# Altium schematic sheet Power.SchDoc
size A4; SheetNumber: 2; SheetTotal: 3
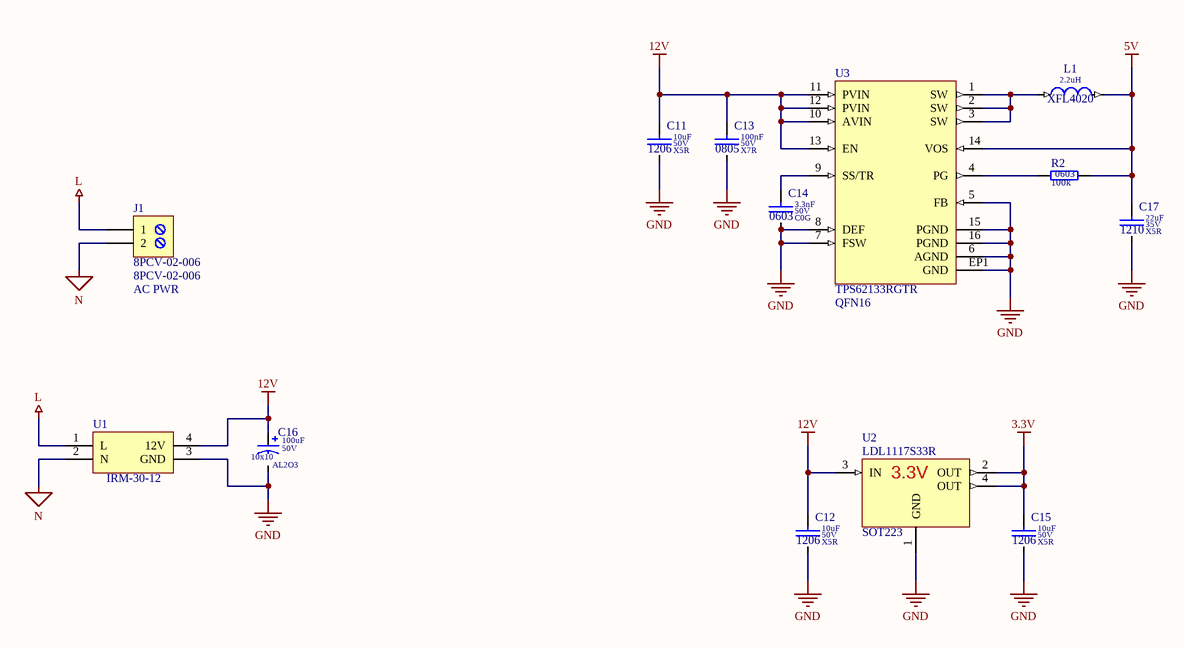
[diagram p0: Power.SchDoc]

## Parts
C11  value 10uF  Dielectric: X5R  Voltage: 50V  SCH_Footprint: 1206  [C_1206_3216]  (hidden comment: Ceramic X5R)
C12  value 10uF  Dielectric: X5R  Voltage: 50V  SCH_Footprint: 1206  [C_1206_3216]  (hidden comment: Ceramic X5R)
C13  value 100nF  Dielectric: X7R  Voltage: 50V  SCH_Footprint: 0805  [C_0805_2012]  (hidden comment: Ceramic X7R)
C14  value 3.3nF  Dielectric: C0G  Voltage: 50V  SCH_Footprint: 0603  [C_0603_1608]  (hidden comment: Ceramic C0G)
C15  value 10uF  Dielectric: X5R  Voltage: 50V  SCH_Footprint: 1206  [C_1206_3216]  (hidden comment: Ceramic X5R)
C16  value 100uF  Dielectric: AL2O3  SCH_Footprint: 10x10  Voltage: 50V  [CE_D_10x10_SMD]  (hidden comment: Electrolytic Capacitor)
C17  value 22uF  Dielectric: X5R  Voltage: 35V  SCH_Footprint: 1210  [C_1210_3225]  (hidden comment: Ceramic X5R)
J1  value 8PCV-02-006  [J_8PCV-02-006]  (hidden comment: 600V 30A connector)
L1  value 2.2uH  [XFL4020]  (hidden comment: Inductor)
R2  value 100k  SCH_Footprint: 0603  [R_0603_1608]  (hidden comment: Resistor)
U1  IRM-30-12  [IRM-30-12]
U2  SCH_Footprint: SOT223  [SOT223_SC73]  (hidden comment: LDL1117S33R)
U3  SCH_Footprint: QFN16  [QFN16_3x3]  (hidden comment: TPS62133RGTR)

## Nets
3.3V: C15.1 U2.2(OUT) U2.4(OUT)
5V: C17.1 L1.2 R2.2 U3.14(VOS)
12V: C11.1 C12.1 C13.1 C16.1 U1.4(12V) U2.3(IN) U3.10(AVIN) U3.11(PVIN) U3.12(PVIN) U3.13(EN)
GND: C11.2 C12.2 C13.2 C14.2 C15.2 C16.2 C17.2 U1.3(GND) U2.1(GND) U3.5(FB) U3.6(AGND) U3.7(FSW) U3.8(DEF) U3.15(PGND) U3.16(PGND) U3.EP1(GND)
L: J1.1 U1.1(L)
N: J1.2 U1.2(N)
NetC14_1: C14.1 U3.9(SS/TR)
NetL1_1: L1.1 U3.1(SW) U3.2(SW) U3.3(SW)
NetR2_1: R2.1 U3.4(PG)

## Notes on the sheet
- (near J1) AC PWR

## Library data of the parts
C11 C12 C15 = C_10uF_50V_X5R_1206_10: Capacitor; Manufacturer: Murata; Manufacturer Part Number: GRM31CR61H106KA12L; Tolerance (%): 10; Part Number: C_10uF_50V_X5R_1206_10; HelpURL: https://datasheet.octopart.com/GRM31CR61H106KA12L-Murata-datasheet-138746367.pdf; Supplier 1: TME; Supplier Part Number 1: GRM31CR61H106KA12L; Supplier 2: RS Components; Supplier 3: Farnell; Supplier Part Number 3: 1845762; Supplier 4: Mouser; Supplier 5: Digi-Key; Supplier 6: LCSC
C13 = C_100nF_50V_X7R_0805_10: Capacitor; Manufacturer: AVX; Manufacturer Part Number: 08055C104K4T2A; Tolerance (%): 10; Part Number: C_100nF_50V_X7R_0805_10; HelpURL: http://www.tme.eu/pl/Document/943bdb20b23b898c4d4b2ec4eca4f2b6/cauto.pdf; Supplier 1: TME; Supplier Part Number 1: 08055C104K4T2A; Supplier 2: RS Components; Supplier 3: Farnell; Supplier 4: Mouser; Supplier 5: Digi-Key; Supplier 6: LCSC
C14 = C_3.3nF_50V_C0G_0603_5: Capacitor; Manufacturer: Murata; Manufacturer Part Number: GRM1885C1H332JA01D; Tolerance (%): 5; Part Number: C_3.3nF_50V_C0G_0603_5; HelpURL: https://www.murata.com/~/media/webrenewal/support/library/catalog/products/capacitor/mlcc/c02e.ashx; Supplier 1: TME; Supplier Part Number 1: GRM1885C1H332JA01D; Supplier 2: RS Components; Supplier Part Number 2: 7235900; Supplier 3: Farnell; Supplier Part Number 3: 2470483; Supplier 4: Mouser; Supplier Part Number 4: 81-GRM1885C1H332JA1D; Supplier 5: Digi-Key; Supplier Part Number 5: 490-6385-1-ND; Supplier 6: LCSC
C16 = CE_100uF_50V_AL2O3_10x10_20: Polarized Capacitor; Manufacturer: Nichicon; Manufacturer Part Number: UUX1H101MNL1GS; Tolerance (%): 20; Part Number: CE_100uF_50V_AL2O3_10x10_20; HelpURL: https://datasheet.octopart.com/UUX1H101MNL1GS-Nichicon-datasheet-62047998.pdf; Supplier 1: TME; Supplier Part Number 1: UUX1H101MNL1GS; Supplier 2: RS Components; Supplier Part Number 2: 7393107; Supplier 3: Farnell; Supplier Part Number 3: 2841943; Supplier 4: Mouser; Supplier Part Number 4: 647-UUX1H101MNL1GS; Supplier 5: Digi-Key; Supplier Part Number 5: 493-6269-1-ND; Supplier 6: LCSC
C17 = C_22uF_35V_X5R_1210_20: Capacitor; Manufacturer: Taiyo Yuden; Manufacturer Part Number: GMK325BJ226MM-P; Tolerance (%): 20; Part Number: C_22uF_35V_X5R_1210_20; HelpURL: https://datasheet.octopart.com/GMK325BJ226MM-P-Taiyo-Yuden-datasheet-138516745.pdf; Supplier 1: TME; Supplier 2: RS Components; Supplier Part Number 2: 103-4209; Supplier 3: Farnell; Supplier 4: Mouser; Supplier Part Number 4: 963-GMK325BJ226MM-P; Supplier 5: Digi-Key; Supplier Part Number 5: 587-5853-6-ND; Supplier 6: LCSC
J1 = J_8PCV-02-006: ARK Screw terminal, 2-Pin; Manufacturer: TE Connectivity; SCH_Footprint: 8PCV-02-006; Part Number: J_8PCV-02-006; HelpURL: http://www.mouser.com/ds/2/418/NG_CD_6-1437657-3_K4-669783.pdf; Manufacturer Part Number: 8PCV-02-006; Supplier 1: TME; Supplier 2: RS Components; Supplier Part Number 2: 7176637; Supplier 3: Farnell; Supplier 4: Mouser; Supplier Part Number 4: 571-514376577; Supplier 5: Digi-Key; Supplier Part Number 5: A98460-ND; Supplier 6: LCSC
L1 = L_2.2uH_8A_XFL4020: Induction; Manufacturer: Coilcraft; Manufacturer Part Number: XFL4020-222MEC; Current: 8A; Resistance: 23.5mR; SCH_Footprint: XFL4020; Part Number: L_2.2uH_8A_XFL4020; HelpURL: https://pl.mouser.com/datasheet/2/597/xfl4020-270756.pdf; Supplier 1: TME; Supplier 2: RS Components; Supplier 3: Farnell; Supplier Part Number 3: 2289216; Supplier 4: Mouser; Supplier Part Number 4: 994-XFL4020-222MEC; Supplier 5: Digi-Key; Supplier 6: LCSC; Supplier 7: Coilcraft; Supplier Part Number 7: XFL4020-222MEC
R2 = R_100k_0603_1: Manufacturer: Royalohm; Manufacturer Part Number: 0603SAF1003T5E; Voltage: 50V; Power: 100mW; Tolerance: 1%; Part Number: R_100k_0603_1; HelpURL: http://www.tme.eu/pl/Document/b315665a56acbc42df513c99b390ad98/ROYALOHM-THICKFILM.pdf; Supplier 1: TME; Supplier Part Number 1: SMD0603-100K-1%; Supplier 2: RS Components; Supplier 3: Farnell; Supplier 4: Mouser; Supplier Part Number 4: 667-ERJ-3EKF1003V; Supplier 5: Digi-Key; Supplier Part Number 5: P100KHCT-ND; Supplier 6: LCSC
U1 = IRM-30-12: IRM-30-12 Mean Well
U2 = VL_LDL1117S33R: typical configuration; Manufacturer: STMicroelectronics; Voltage: 3.3V; Current: 1.2A; Value: LDL1117S33R; Part Number: VL_LDL1117S33R; HelpURL: https://www.st.com/resource/en/datasheet/ldl1117.pdf; Manufacturer Part Number: LDL1117S33R; Supplier 1: TME; Supplier Part Number 1: LDL1117S33R; Supplier 2: RS Components; Supplier 3: Farnell; Supplier Part Number 3: 2729708; Supplier 4: Mouser; Supplier Part Number 4: 511-LDL1117S33R; Supplier 5: Digi-Key; Supplier Part Number 5: 497-17239-1-ND; Supplier 6: LCSC
U3 = VS_TPS62133RGTR: 3-17V 3A Step-Down Converter with DCS-Control in 3x3 QFN; Manufacturer: Texas Instruments; Frequency (kHz): 2500; Topology: Buck; Vin min (V): 3; Vin max (V): 17; Vout min (V): 5; Iswitch (A): 0; Value: TPS62133RGTR; Part Number: VS_TPS62133RGTR; Vout max (V): 5; Imax (A): 3; HelpURL: https://www.ti.com/lit/ds/symlink/tps62133.pdf?ts=1622201106793&ref_url=https%253A%252F%252Fwww.ti.com%252Fproduct%252FTPS62133%253FHQS%253DTI-null-null-octopart-df-pf-null-wwe; Manufacturer Part Number: TPS62133RGTR; Supplier 1: TME; Supplier 2: RS Components; Supplier 3: Farnell; Supplier Part Number 3: 3122975; Supplier 4: Mouser; Supplier Part Number 4: 595-TPS62133RGTR; Supplier 5: Digi-Key; Supplier Part Number 5: 296-29937-1-ND; Supplier 6: LCSC; Supplier Part Number 6: C73973